# Altium project PCB_Project1.PrjPCB
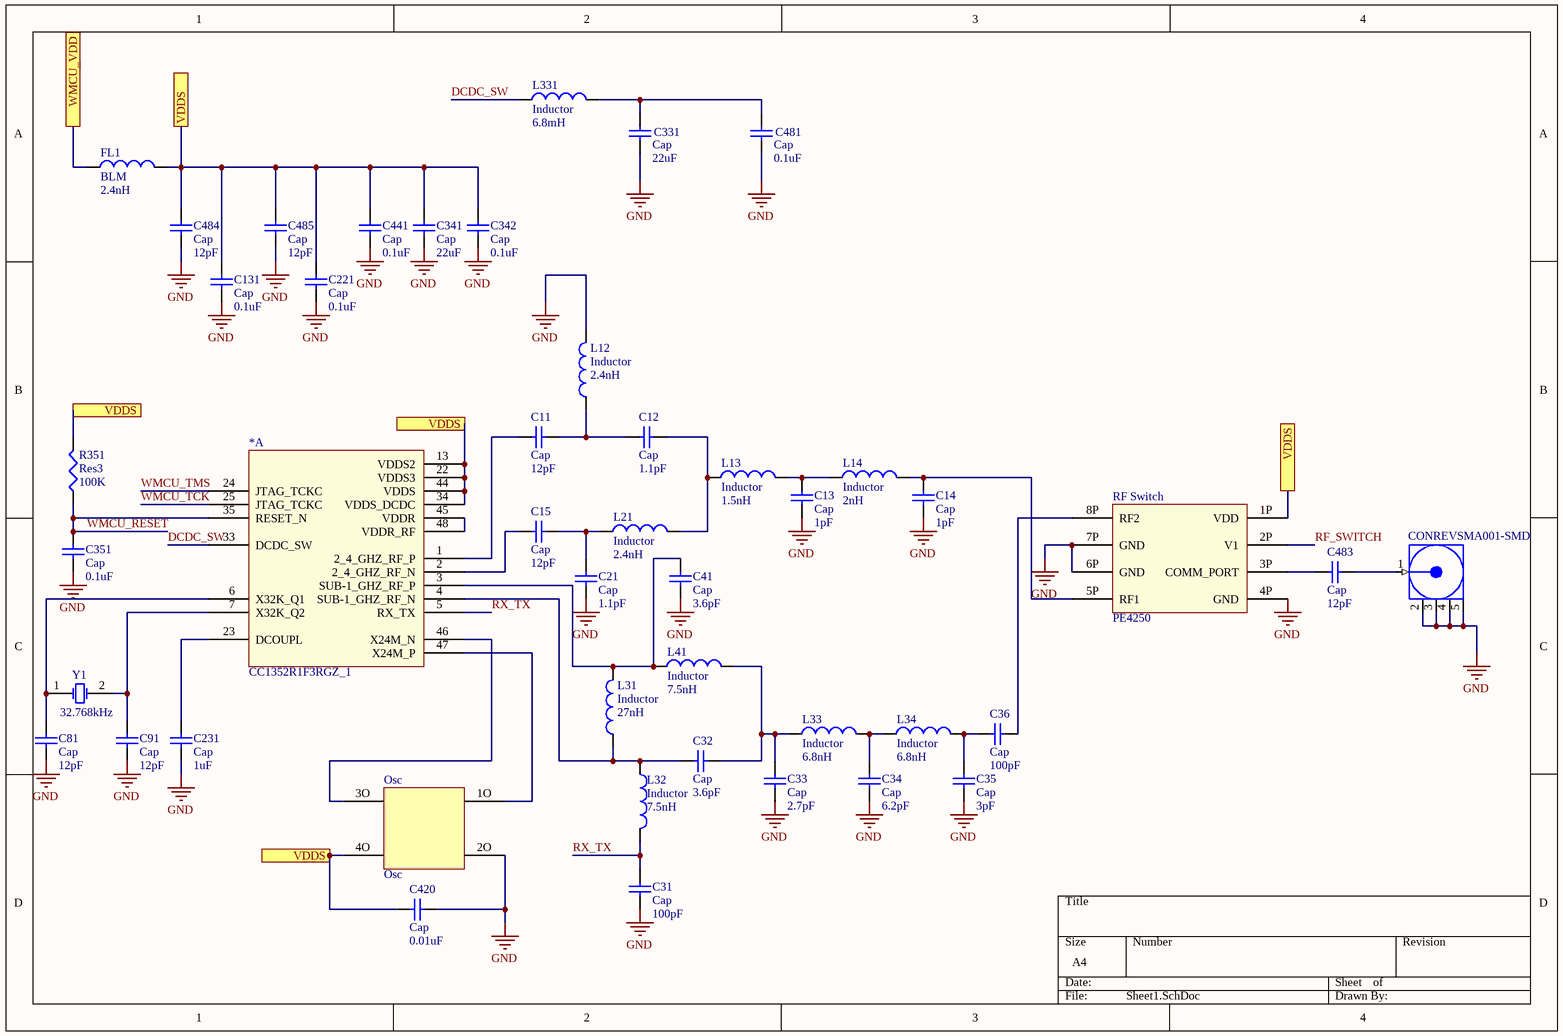
[diagram p0: Sheet1.SchDoc]
2 sheets, 53 parts. Net scope: global (net labels, ports and power ports of the same name join across sheets).
Board file: PCB.PcbDoc
Sheets:
  Sheet1.SchDoc
  Sheet2.SchDoc

## Sheet Sheet1.SchDoc
size A4

### Parts
(Parts that share a designator on the sheet are numbered #1, #2 ... from top to bottom, then left to right.)
*#1  CC1352R1F3RGZ_1  [CC1352R]  (part A of 2)
C11  Cap  value 12pF  [1206 Real]
C12  Cap  value 1.1pF  [0805 Real]
C13  Cap  value 1pF  [1206 Real]
C14  Cap  value 1pF  [1206 Real]
C15  Cap  value 12pF  [1206 Real]
C21  Cap  value 1.1pF  [0805 Real]
C31  Cap  value 100pF  [1206 Real]
C32  Cap  value 3.6pF  [0805 Real]
C33  Cap  value 2.7pF  [1206 Real]
C34  Cap  value 6.2pF  [0805 Real]
C35  Cap  value 3pF  [1206 Real]
C36  Cap  value 100pF  [1206 Real]
C41  Cap  value 3.6pF  [0805 Real]
C81  Cap  value 12pF  [1206 Real]
C91  Cap  value 12pF  [1206 Real]
C131  Cap  value 0.1uF  [1206 Real]
C221  Cap  value 0.1uF  [1206 Real]
C231  Cap  value 1uF  [1206 Real]
C331  Cap  value 22uF  [1206 Real]
C341  Cap  value 22uF  [1206 Real]
C342  Cap  value 0.1uF  [1206 Real]
C351  Cap  value 0.1uF  [1206 Real]
C420  Cap  value 0.01uF  [0805 Real]
C441  Cap  value 0.1uF  [1206 Real]
C481  Cap  value 0.1uF  [1206 Real]
C483  Cap  value 12pF  [1206 Real]
C484  Cap  value 12pF  [1206 Real]
C485  Cap  value 12pF  [1206 Real]
CONREVSMA001-SMD  (no value)  [SMA_Jack]
FL1  BLM  value 2.4nH  [0603]
L12  Inductor  value 2.4nH  [0603]
L13  Inductor  value 1.5nH  [0805 Real]
L14  Inductor  value 2nH  [0603]
L21  Inductor  value 2.4nH  [0603]
L31  Inductor  value 27nH  [0805 Real]
L32  Inductor  value 7.5nH  [0603]
L33  Inductor  value 6.8nH  [0805 Real]
L34  Inductor  value 6.8nH  [0805 Real]
L41  Inductor  value 7.5nH  [0603]
L331  Inductor  value 6.8mH  [Non-Standard Inductor]
Osc  Osc  [OSC]
R351  Res3  value 100K  [1206 Real]
RF_Switch  PE4250  [RF Switch]
Y1  32.768kHz  [R38]

### Ports
VDDS, WMCU_VDD

### Nets
GND: C13.1 C14.1 C21.1 C31.2 C33.1 C34.1 C35.1 C41.1 C81.2 C91.2 C131.2 C221.2 C231.2 C331.2 C341.2 C342.2 C351.2 C420.2 C441.2 C481.2 C484.2 C485.2 CONREVSMA001-SMD.2(GND) CONREVSMA001-SMD.3(GND) CONREVSMA001-SMD.4(GND) CONREVSMA001-SMD.5(GND) L12.2 Osc.2O RF_Switch.4P(GND) RF_Switch.6P(GND) RF_Switch.7P(GND)
DCDC_SW: *#1.33(DCDC_SW) L331.1
RF_SWITCH: RF_Switch.2P(V1)
RX_TX: *#1.5(RX_TX) C31.1 L32.2
WMCU_RESET: *#1.35(RESET_N) C351.1 R351.1
WMCU_TCK: *#1.25(JTAG_TCKC)
WMCU_TMS: *#1.24(JTAG_TCKC)
Net*#1_1: *#1.1(2_4_GHZ_RF_P) C11.1
Net*#1_2: *#1.2(2_4_GHZ_RF_N) C15.1
Net*#1_3: *#1.3(SUB-1_GHZ_RF_P) C41.2 L31.2 L41.1
Net*#1_4: *#1.4(SUB-1_GHZ_RF_N) C32.1 L31.1 L32.1
Net*#1_6: *#1.6(X32K_Q1) C81.1 Y1.1(OSC1)
Net*#1_7: *#1.7(X32K_Q2) C91.1 Y1.2(OSC2)
Net*#1_13: *#1.13(VDDS2) *#1.22(VDDS3) *#1.34(VDDS_DCDC) *#1.44(VDDS) C131.1 C221.1 C341.1 C342.1 C420.1 C441.1 C484.1 C485.1 FL1.2 Osc.4O R351.2 RF_Switch.1P(VDD) ; port VDDS
Net*#1_23: *#1.23(DCOUPL) C231.1
Net*#1_45: *#1.45(VDDR) *#1.48(VDDR_RF)
Net*#1_46: *#1.46(X24M_N) Osc.3O
Net*#1_47: *#1.47(X24M_P) Osc.1O
NetC11_2: C11.2 C12.1 L12.1
NetC12_2: C12.2 L13.1 L21.2
NetC13_2: C13.2 L13.2 L14.1
NetC14_2: C14.2 L14.2 RF_Switch.5P(RF1)
NetC15_2: C15.2 C21.2 L21.1
NetC32_2: C32.2 C33.2 L33.1 L41.2
NetC34_2: C34.2 L33.2 L34.1
NetC35_2: C35.2 C36.1 L34.2
NetC36_2: C36.2 RF_Switch.8P(RF2)
NetC331_1: C331.1 C481.1 L331.2
NetC483_1: C483.1 RF_Switch.3P(COMM_PORT)
NetC483_2: C483.2 CONREVSMA001-SMD.1(Signal)
NetFL1_1: FL1.1 ; port WMCU_VDD

### Library data of the parts
C11-C15 C21 C31-C36 C41 C81 C91 C131 C221 C231 C331 C341 C342 C351 C420 C441 C481 C483-C485 = Cap: Capacitor; Published: 8-Jun-2000; LatestRevisionDate: 17-Jul-2002; LatestRevisionNote: Re-released for DXP Platform.; PackageReference: RAD-0.3; Publisher: Altium Limited; PackageDescription: Radial Cap, Thru-Hole; 2 Leads; 0.3 in Pin Spacing
CONREVSMA001-SMD = COAX-M: RF Coaxial PCB Connector, MMCX; Thru-Hole, Vertical Mount Plug,  50 Ohm Impedance; PackageDocument: Rev. A, 16-Jun-1997; PCB_Layout: Complies with manufacturer's recommendation.; DrillSize: Corresponds to nominal value.; Published: 15-Jul-2004; LatestRevisionDate: 15-Jul-2004; LatestRevisionNote: Component Replaced.; DatasheetDocument: 30-May-2003; PackageReference: 908-21103; Publisher: Altium Limited; ComponentLink1Description: Manufacturer Link; ComponentLink1URL: http://www.amphenolrf.com/
FL1 L12-L14 L21 L31-L34 L41 L331 = Inductor: Code_IEC: 1005; Published: 8-Jun-2000; LatestRevisionDate: 29-May-2009; LatestRevisionNote: IPC-7351 Footprint Added.; PackageReference: 0402-A; Publisher: Altium Limited; PackageDescription: Chip Inductor; Code_JEITA: 0402
R351 = Res3: Resistor; Published: 8-Jun-2000; LatestRevisionDate: 29-May-2009; LatestRevisionNote: IPC-7351 Footprint Added.; PackageReference: J1-0603; Publisher: Altium Limited; PackageDescription: Chip Resistor
Y1 = XTAL: Crystal Oscillator; Published: 8-Jun-2000; LatestRevisionDate: 17-Jul-2002; LatestRevisionNote: Re-released for DXP Platform.; PackageReference: R38; Publisher: Altium Limited; PackageDescription: Crystal, Thru-Hole; 2 Leads; Body 3.1 x 8.2 mm (Dia.xH)

## Sheet Sheet2.SchDoc
size A4
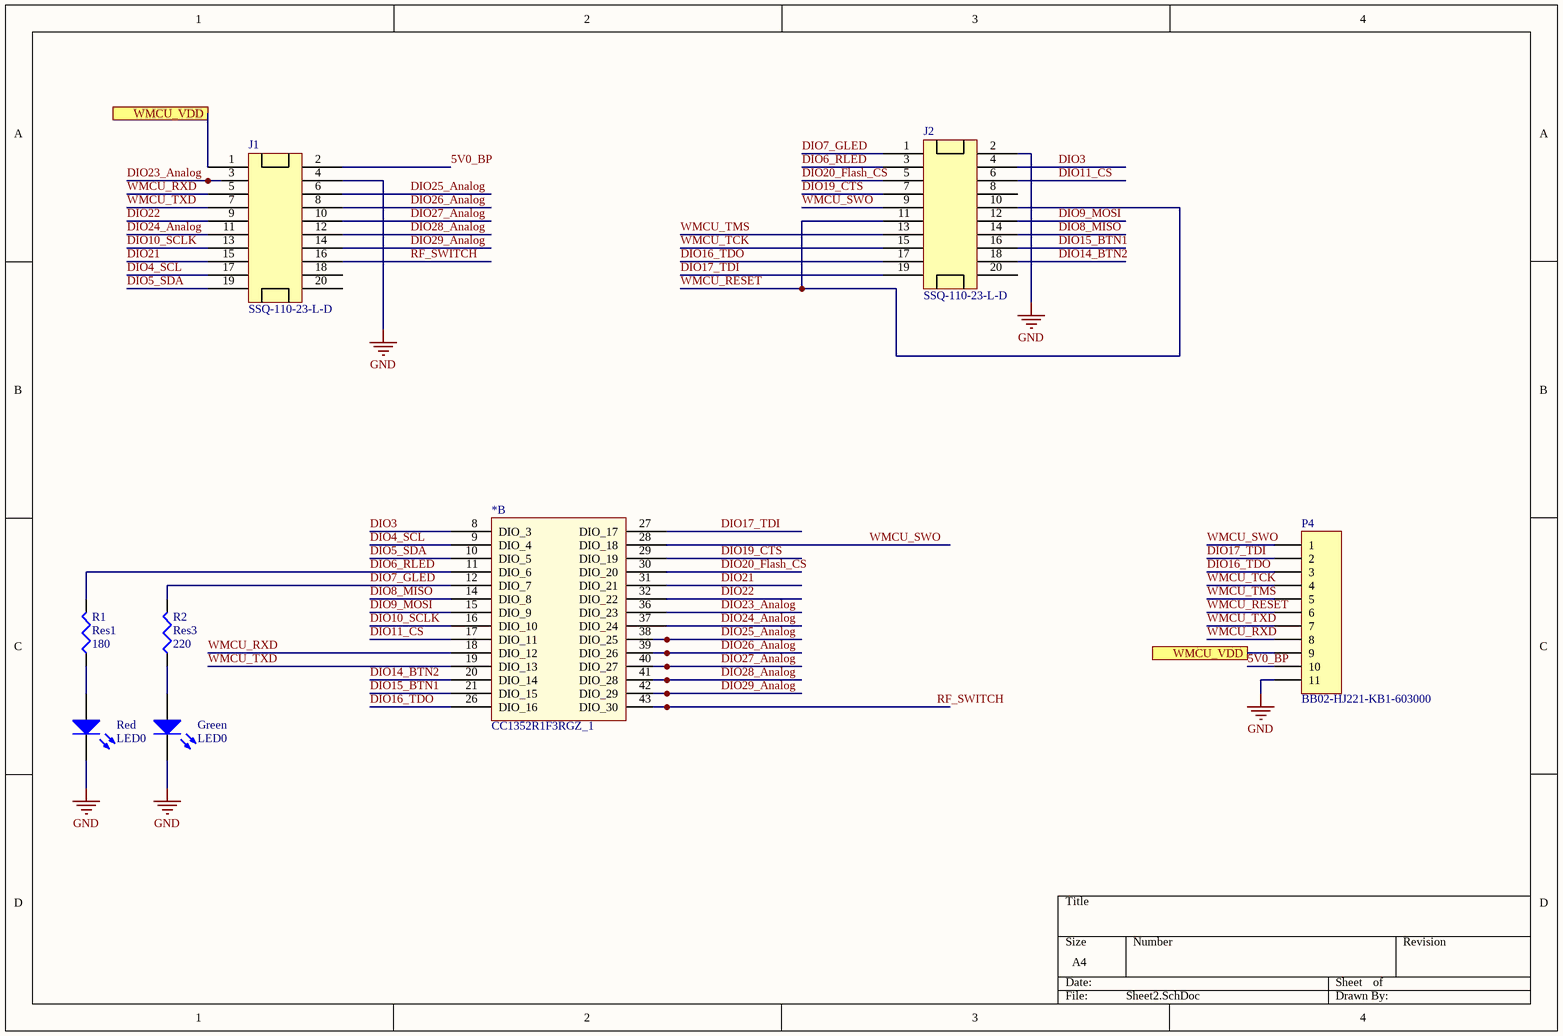
[diagram p1: Sheet2.SchDoc]

### Parts
(Parts that share a designator on the sheet are numbered #1, #2 ... from top to bottom, then left to right.)
*#2  CC1352R1F3RGZ_1  [CC1352R]  (part B of 2)
Green  LED0  [1206 Real]
J1  SSQ-110-23-L-D
J2  SSQ-110-23-L-D
P4  BB02-HJ221-KB1-603000  [HDR1X11]
R1  Res1  value 180  [1206 Real]
R2  Res3  value 220  [1206 Real]
Red  LED0  [1206 Real]

### Ports
WMCU_VDD

### Nets
GND: Green.2(K) J1.4 J2.2 P4.11 Red.2(K)
5V0_BP: J1.2 P4.10
DIO3: *#2.8(DIO_3) J2.4
DIO4_SCL: *#2.9(DIO_4) J1.17
DIO5_SDA: *#2.10(DIO_5) J1.19
DIO6_RLED: *#2.11(DIO_6) J2.3 R1.2
DIO7_GLED: *#2.12(DIO_7) J2.1 R2.2
DIO8_MISO: *#2.14(DIO_8) J2.14
DIO9_MOSI: *#2.15(DIO_9) J2.12
DIO10_SCLK: *#2.16(DIO_10) J1.13
DIO11_CS: *#2.17(DIO_11) J2.6
DIO14_BTN2: *#2.20(DIO_14) J2.18
DIO15_BTN1: *#2.21(DIO_15) J2.16
DIO16_TDO: *#2.26(DIO_16) J2.17 P4.3
DIO17_TDI: *#2.27(DIO_17) J2.19 P4.2
DIO19_CTS: *#2.29(DIO_19) J2.7
DIO20_Flash_CS: *#2.30(DIO_20) J2.5
DIO21: *#2.31(DIO_21) J1.15
DIO22: *#2.32(DIO_22) J1.9
DIO23_Analog: *#2.36(DIO_23) J1.3
DIO24_Analog: *#2.37(DIO_24) J1.11
DIO25_Analog: *#2.38(DIO_25) J1.6
DIO26_Analog: *#2.39(DIO_26) J1.8
DIO27_Analog: *#2.40(DIO_27) J1.10
DIO28_Analog: *#2.41(DIO_28) J1.12
DIO29_Analog: *#2.42(DIO_29) J1.14
RF_SWITCH: *#2.43(DIO_30) J1.16
WMCU_RESET: J2.10 J2.11 P4.6
WMCU_RXD: *#2.18(DIO_12) J1.5 P4.8
WMCU_SWO: *#2.28(DIO_18) J2.9 P4.1
WMCU_TCK: J2.15 P4.4
WMCU_TMS: J2.13 P4.5
WMCU_TXD: *#2.19(DIO_13) J1.7 P4.7
NetFL1_1: J1.1 P4.9 ; port WMCU_VDD
NetGreen_1: Green.1(A) R2.1
NetR1_1: R1.1 Red.1(A)

Not connected (* = marked no-connect by the designer): J1 18 20; J2 8 20

### Library data of the parts
Green Red = LED0: Typical INFRARED GaAs LED; Published: 8-Jun-2000; LatestRevisionDate: 08-Jul-2005; LatestRevisionNote: Mech Layer 1 removed.; PackageReference: LED-0; Publisher: Altium Limited; PackageDescription: LED; 2 Leads
P4 = Header 11: Header, 11-Pin; LatestRevisionDate: 17-Jul-2002; LatestRevisionNote: Re-released for DXP Platform.; Publisher: Altium Limited
R1 R2 = Res3: Resistor; Published: 8-Jun-2000; LatestRevisionDate: 29-May-2009; LatestRevisionNote: IPC-7351 Footprint Added.; PackageReference: J1-0603; Publisher: Altium Limited; PackageDescription: Chip Resistor

## Nets that join several sheets
GND: Sheet1 (31 pins), Sheet2 (5 pins)
NetFL1_1: Sheet1 (FL1.1), Sheet2 (J1.1 P4.9)
RF_SWITCH: Sheet1 (RF_Switch.2P), Sheet2 (*#2.43 J1.16)
WMCU_RESET: Sheet1 (*#1.35 C351.1 R351.1), Sheet2 (J2.10 J2.11 P4.6)
WMCU_TCK: Sheet1 (*#1.25), Sheet2 (J2.15 P4.4)
WMCU_TMS: Sheet1 (*#1.24), Sheet2 (J2.13 P4.5)